# Altium project Screen test.PrjPcb
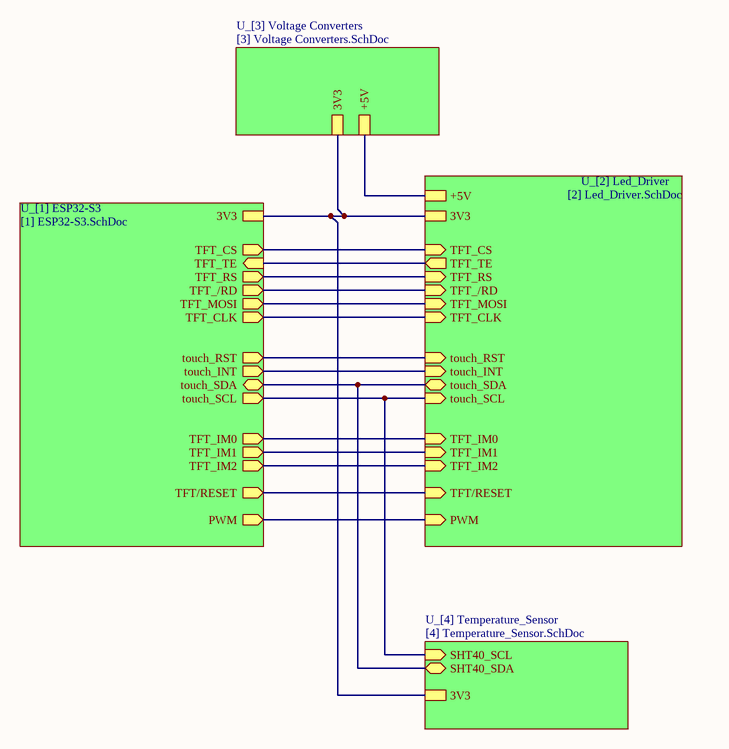
[diagram p0: [0] General.SchDoc]
5 sheets, 88 parts. Net scope: hierarchical (ports join the sheet entries above them; power ports are global).
Board file: ESP32-S3.PcbDoc
Sheets:
  [0] General.SchDoc
    U_[1] ESP32-S3 = [1] ESP32-S3.SchDoc
    U_[2] Led_Driver = [2] Led_Driver.SchDoc
    U_[4] Temperature_Sensor = [4] Temperature_Sensor.SchDoc
    U_[3] Voltage Converters = [3] Voltage Converters.SchDoc

## Sheet [0] General.SchDoc
size A4; Organization: Altium Limited; Address1: L3, 12a Rodborough Rd; Address2: Frenchs Forest; Address3: NSW; Address4: Australia 2086

### Sub-sheets
U_[1] ESP32-S3 = [1] ESP32-S3.SchDoc: TFT_CLK (out), TFT_CS (out), TFT_MOSI (out), touch_SCL (out), TFT_IM0 (out), TFT_IM1 (out), TFT_IM2 (out), touch_INT (out), TFT_TE (in), TFT_RS (out), TFT_/RD (out), TFT/RESET (out), touch_RST (out), PWM (out), touch_SDA (bidir), 3V3
U_[2] Led_Driver = [2] Led_Driver.SchDoc: PWM (in), TFT_TE (out), TFT_RS (in), TFT_/RD (in), TFT_IM0 (in), TFT_IM1 (in), TFT_IM2 (in), TFT/RESET (in), TFT_CLK (in), TFT_CS (in), TFT_MOSI (in), touch_INT (in), touch_RST (in), touch_SCL (in), touch_SDA (bidir), +5V, 3V3
U_[3] Voltage Converters = [3] Voltage Converters.SchDoc: +5V, 3V3
U_[4] Temperature_Sensor = [4] Temperature_Sensor.SchDoc: SHT40_SCL (in), SHT40_SDA (bidir), 3V3

### Nets
+5V: sheet U_[2] Led_Driver/+5V, sheet U_[3] Voltage Converters/+5V
VDD3P3: sheet U_[1] ESP32-S3/3V3, sheet U_[2] Led_Driver/3V3, sheet U_[4] Temperature_Sensor/3V3, sheet U_[3] Voltage Converters/3V3
TFT/RESET: sheet U_[1] ESP32-S3/TFT/RESET, sheet U_[2] Led_Driver/TFT/RESET
touch_RST: sheet U_[1] ESP32-S3/touch_RST, sheet U_[2] Led_Driver/touch_RST
NetJ2_4: sheet U_[1] ESP32-S3/touch_INT, sheet U_[2] Led_Driver/touch_INT
NetJ2_5: sheet U_[1] ESP32-S3/touch_SCL, sheet U_[2] Led_Driver/touch_SCL, sheet U_[4] Temperature_Sensor/SHT40_SCL
NetJ2_6: sheet U_[1] ESP32-S3/touch_SDA, sheet U_[2] Led_Driver/touch_SDA, sheet U_[4] Temperature_Sensor/SHT40_SDA
NetJ3_08: sheet U_[1] ESP32-S3/TFT_TE, sheet U_[2] Led_Driver/TFT_TE
NetJ3_09: sheet U_[1] ESP32-S3/TFT_CS, sheet U_[2] Led_Driver/TFT_CS
NetJ3_10: sheet U_[1] ESP32-S3/TFT_RS, sheet U_[2] Led_Driver/TFT_RS
NetJ3_11: sheet U_[1] ESP32-S3/TFT_CLK, sheet U_[2] Led_Driver/TFT_CLK
NetJ3_12: sheet U_[1] ESP32-S3/TFT_/RD, sheet U_[2] Led_Driver/TFT_/RD
NetJ3_13: sheet U_[1] ESP32-S3/TFT_MOSI, sheet U_[2] Led_Driver/TFT_MOSI
NetJ3_37: sheet U_[1] ESP32-S3/TFT_IM0, sheet U_[2] Led_Driver/TFT_IM0
NetJ3_38: sheet U_[1] ESP32-S3/TFT_IM1, sheet U_[2] Led_Driver/TFT_IM1
NetJ3_39: sheet U_[1] ESP32-S3/TFT_IM2, sheet U_[2] Led_Driver/TFT_IM2
NetU1_1: sheet U_[1] ESP32-S3/PWM, sheet U_[2] Led_Driver/PWM

### Notes on the sheet
- Title
- Size:
- Date:
- A4
- Number:
- Time:
- Revision:
- Sheet
- of
- File:

## Sheet [1] ESP32-S3.SchDoc: ESP32-S3
size OrCAD B; DocumentNumber: 01; Revision: 01; SheetNumber: 01
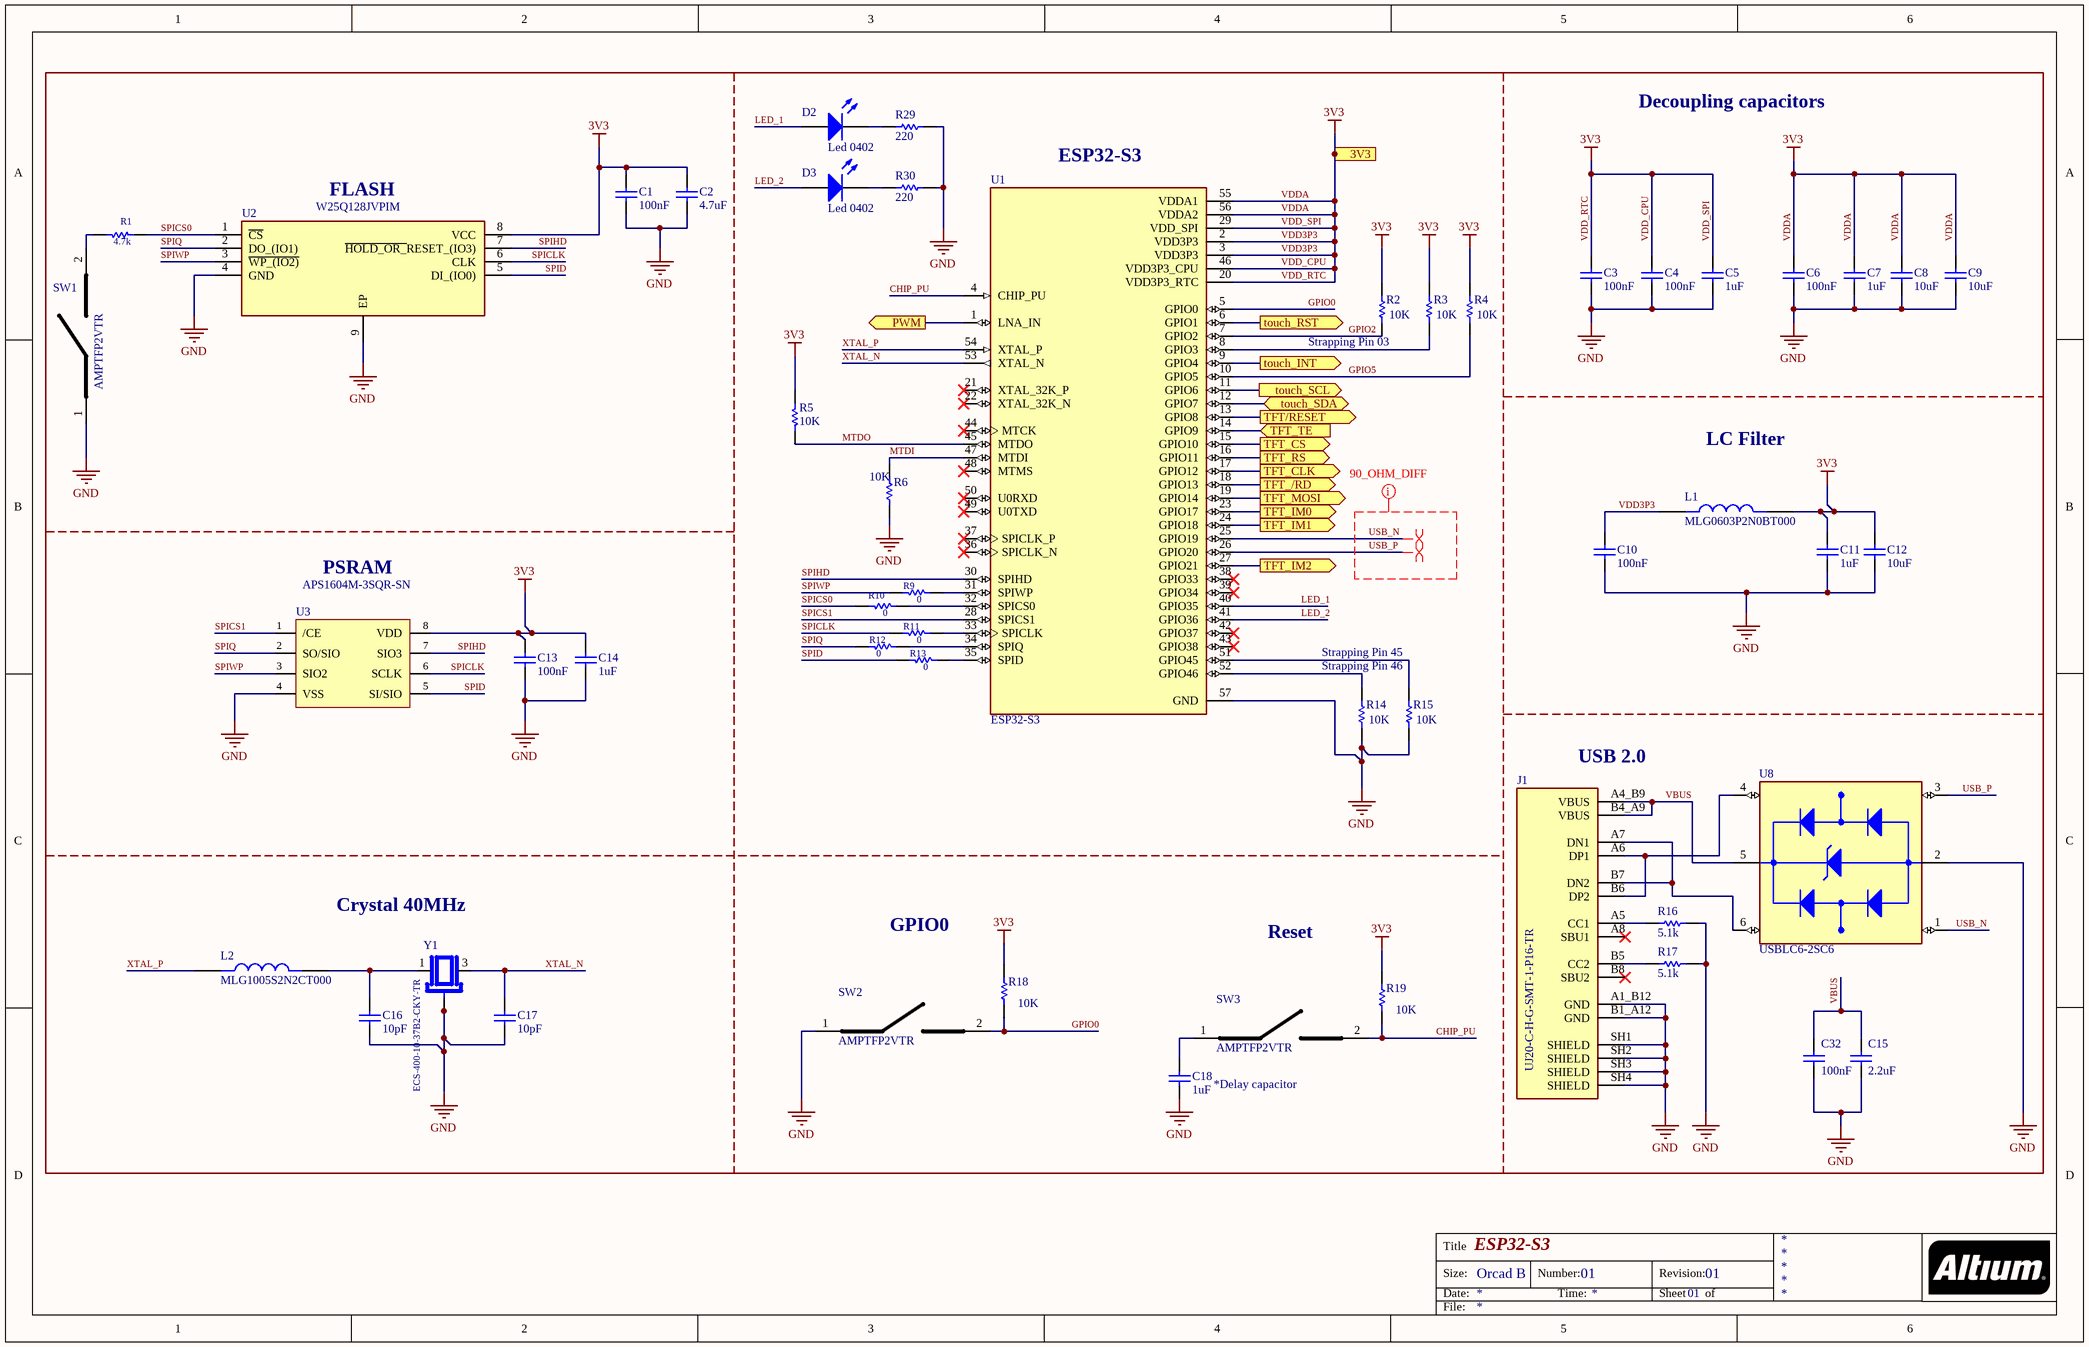
[diagram p1: [1] ESP32-S3.SchDoc]

### Parts
C1  100nF  [Capacitor 0402]
C2  4.7uF  [Capacitor 0402]
C3  100nF  [Capacitor 0402]
C4  100nF  [Capacitor 0402]
C5  1uF  [Capacitor 0402]
C6  100nF  [Capacitor 0402]
C7  1uF  [Capacitor 0402]
C8  10uF  [Capacitor 0603]
C9  10uF  [Capacitor 0603]
C10  100nF  [Capacitor 0402]
C11  1uF  [Capacitor 0402]
C12  10uF  [Capacitor 0603]
C13  100nF  [Capacitor 0402]
C14  1uF  [Capacitor 0402]
C15  2.2uF  [Capacitor 0402]
C16  10pF  [Capacitor 0402]
C17  10pF  [Capacitor 0402]
C18  1uF  [Capacitor 0402]
C32  100nF  [Capacitor 0402]
D2  Led 0402  [LED 0402]
D3  Led 0402  [LED 0402]
J1  UJ20-C-H-G-SMT-1-P16-TR  [SAMESKY_UJ20-C-H-G-SMT-1-P16-TR]
L1  MLG0603P2N0BT000  [INDC0603X33N]
L2  MLG1005S2N2CT000  [INDC1005X55N]
R1  4.7k  [Resistencia 0402]
R2  10K  [Resistencia 0402]
R3  10K  [Resistencia 0402]
R4  10K  [Resistencia 0402]
R5  10K  [Resistencia 0402]
R6  10K  [Resistencia 0402]
R9  0  [Resistencia 0402]
R10  0  [Resistencia 0402]
R11  0  [Resistencia 0402]
R12  0  [Resistencia 0402]
R13  0  [Resistencia 0402]
R14  10K  [Resistencia 0402]
R15  10K  [Resistencia 0402]
R16  5.1k  [Resistencia 0402]
R17  5.1k  [Resistencia 0402]
R18  10K  [Resistencia 0402]
R19  10K  [Resistencia 0402]
R29  220  [Resistencia 0402]
R30  220  [Resistencia 0402]
SW1  AMPTFP2VTR  [AMPTFP2VTR]
SW2  AMPTFP2VTR  [AMPTFP2VTR]
SW3  AMPTFP2VTR  [AMPTFP2VTR]
U1  ESP32-S3  [IC_ESP32-S3]
U2  W25Q128JVPIM  [SON127P600X500X80-9N-D]
U3  APS1604M-3SQR-SN  [SOIC127P600X165-8N]
U8  USBLC6-2SC6  [SOT95P280X145-6N]
Y1  ECS-400-10-37B2-CKY-TR  [XTAL_ECS-400-10-37B2-CKY-TR]

### Ports
3V3, PWM (out), TFT/RESET (out), TFT_/RD (out), TFT_CLK (out), TFT_CS (out), TFT_IM0 (out), TFT_IM1 (out), TFT_IM2 (out), TFT_MOSI (out), TFT_RS (out), TFT_TE (in), touch_INT (out), touch_RST (out), touch_SCL (out), touch_SDA (bidir)

### Nets
GND: C1.1 C2.1 C3.1 C4.1 C5.1 C6.1 C7.1 C8.1 C9.1 C10.1 C11.1 C12.1 C13.1 C14.1 C15.1 C16.1 C17.1 C18.1 C32.1 J1.A1_B12(GND) J1.B1_A12(GND) J1.SH1(SHIELD) J1.SH2(SHIELD) J1.SH3(SHIELD) J1.SH4(SHIELD) R6.1(A) R14.1(A) R15.1(A) R16.1(A) R17.1(A) R29.2(B) R30.2(B) SW1.1(COM) SW2.1(COM) U1.57(GND) U2.4(GND) U2.9(EP) U3.4(VSS) U8.2(GND) Y1.2(GND) Y1.4(GND)
VDD3P3: C1.2 C2.2 C3.2 C4.2 C5.2 C6.2 C7.2 C8.2 C9.2 C10.2 C11.2 C12.2 C13.2 C14.2 L1.1 L1.2 R2.2(B) R3.2(B) R4.2(B) R5.2(B) R18.2(B) R19.2(B) U1.2(VDD3P3) U1.3(VDD3P3) U1.20(VDD3P3_RTC) U1.29(VDD_SPI) U1.46(VDD3P3_CPU) U1.55(VDDA1) U1.56(VDDA2) U2.8(VCC) U3.8(VDD) ; port 3V3  [also labelled 3V3, VDD_CPU, VDD_RTC, VDD_SPI, VDDA]
CHIP_PU: R19.1(A) SW3.2(NO) U1.4(CHIP_PU)
GPIO0: R18.1(A) SW2.2(NO) U1.5(GPIO0)
GPIO2: R2.1(A) U1.7(GPIO2)
GPIO5: R4.1(A) U1.10(GPIO5)
LED_1: D2.1(A) U1.40(GPIO35)
LED_2: D3.1(A) U1.41(GPIO36)
MTDI: R6.2(B) U1.47(MTDI)
MTDO: R5.1(A) U1.45(MTDO)
SPICLK: R11.2(B) U2.6(CLK) U3.6(SCLK)
SPICS0: R1.1(A) R10.1(A) U2.1(~{CS})
SPICS1: U1.28(SPICS1) U3.1(/CE)
SPID: R13.2(B) U2.5(DI_(IO0)) U3.5(SI/SIO)
SPIHD: U1.30(SPIHD) U2.7(~{HOLD_OR_}RESET_(IO3)) U3.7(SIO3)
SPIQ: R12.2(B) U2.2(DO_(IO1)) U3.2(SO/SIO)
SPIWP: R9.2(B) U2.3(~{WP_(IO2)}) U3.3(SIO2)
TFT/RESET: U1.13(GPIO8) ; port TFT/RESET
touch_RST: U1.6(GPIO1) ; port touch_RST
USB_N: U1.25(GPIO19) U8.1(I/O1_IN)
USB_P: U1.26(GPIO20) U8.3(I/O2_IN)
VBUS: C15.2 C32.2 J1.A4_B9(VBUS) J1.B4_A9(VBUS) U8.5(VBUS)
XTAL_N: C17.2 U1.53(XTAL_N) Y1.3(OUT/IN)
XTAL_P: L2.1 U1.54(XTAL_P)
NetC16_2: C16.2 L2.2 Y1.1(IN/OUT)
NetC18_2: C18.2 SW3.1(COM)
NetD2_2: D2.2(K) R29.1(A)
NetD3_2: D3.2(K) R30.1(A)
NetJ1_A5: J1.A5(CC1) R16.2(B)
NetJ1_A6: J1.A6(DP1) J1.B6(DP2) U8.4(I/O2_OUT)
NetJ1_A7: J1.A7(DN1) J1.B7(DN2) U8.6(I/O1_OUT)
NetJ1_B5: J1.B5(CC2) R17.2(B)
NetJ2_4: U1.9(GPIO4) ; port touch_INT
NetJ2_5: U1.11(GPIO6) ; port touch_SCL
NetJ2_6: U1.12(GPIO7) ; port touch_SDA
NetJ3_08: U1.14(GPIO9) ; port TFT_TE
NetJ3_09: U1.15(GPIO10) ; port TFT_CS
NetJ3_10: U1.16(GPIO11) ; port TFT_RS
NetJ3_11: U1.17(GPIO12) ; port TFT_CLK
NetJ3_12: U1.18(GPIO13) ; port TFT_/RD
NetJ3_13: U1.19(GPIO14) ; port TFT_MOSI
NetJ3_37: U1.23(GPIO17) ; port TFT_IM0
NetJ3_38: U1.24(GPIO18) ; port TFT_IM1
NetJ3_39: U1.27(GPIO21) ; port TFT_IM2
NetR1_2: R1.2(B) SW1.2(NO)
NetR3_1: R3.1(A) U1.8(GPIO3)
NetR9_1: R9.1(A) U1.31(SPIWP)
NetR10_2: R10.2(B) U1.32(SPICS0)
NetR11_1: R11.1(A) U1.33(SPICLK)
NetR12_1: R12.1(A) U1.34(SPIQ)
NetR13_1: R13.1(A) U1.35(SPID)
NetR14_2: R14.2(B) U1.52(GPIO46)
NetR15_2: R15.2(B) U1.51(GPIO45)
NetU1_1: U1.1(LNA_IN) ; port PWM

Not connected (* = marked no-connect by the designer): J1 A8(SBU1)* B8(SBU2)*; U1 21(XTAL_32K_P)* 22(XTAL_32K_N)* 36(SPICLK_N)* 37(SPICLK_P)* 38(GPIO33)* 39(GPIO34)* 42(GPIO37)* 43(GPIO38)* 44(MTCK)* 48(MTMS)* 49(U0TXD)* 50(U0RXD)*

### Layout directives
differential pair; differential pair class 90_OHM_DIFF: USB_N, USB_P
mark named 90_OHM_DIFF: USB_N, USB_P

### Notes on the sheet
- Decoupling capacitors
- (near U2) FLASH
- (near U1) ESP32-S3
- (near R2) Strapping Pin 03
- LC Filter
- PSRAM
- Strapping Pin 45
- Strapping Pin 46
- (near J1) USB 2.0
- Crystal 40MHz
- GPIO0
- Reset
- *Delay capacitor
- Title
- Size:
- Date:
- Orcad B
- Number:
- Time:
- Revision:
- Sheet
- of
- File:

### Library data of the parts
C1-C7 C10 C11 C13-C18 C32 = Capacitor 0402: Capacitor Ceramico SMD 0402
C8 C9 C12 = Capacitor 0603: Capacitor Ceramico SMD 0603
D2 D3 = LED 0402: LED SMD 0402
J1 = UJ20-C-H-G-SMT-1-P16-TR: USB-C (USB TYPE-C) USB 2.0 Receptacle Connector 24 (16+8 Dummy) Position Surface Mount, Right Angle; Through Hole; MF: Same Sky; SnapEDA_Link: https://www.snapeda.com/parts/UJ20-C-H-G-SMT-1-P16-TR/Same+Sky/view-part/?ref=snap; Package: None; Value: *; MP: UJ20-C-H-G-SMT-1-P16-TR; Check_prices: https://www.snapeda.com/parts/UJ20-C-H-G-SMT-1-P16-TR/Same+Sky/view-part/?ref=eda
L1 = MLG0603P2N0BT000: 2 nH Unshielded Multilayer Inductor 600 mA 100mOhm Max 0201 (0603 Metric); MF: TDK; Price: None; Check_prices: https://www.snapeda.com/parts/MLG0603P2N0BT000/TDK/view-part/?ref=eda; Package: 0603 Taiyo Yuden; Purchase-URL: https://pricing.snapeda.com/search/part/MLG0603P2N0BT000/?ref=eda; SnapEDA_Link: https://www.snapeda.com/parts/MLG0603P2N0BT000/TDK/view-part/?ref=snap; Value: *; MP: MLG0603P2N0BT000; Availability: In Stock
L2 = MLG1005S2N2CT000: FIXED IND 2.2NH 900MA 150MOHM SM; MF: TDK Corporation; SnapEDA_Link: https://www.snapeda.com/parts/MLG1005S2N2CT000/TDK/view-part/?ref=snap; Package: 1005-2 TDK; Value: *; MP: MLG1005S2N2CT000; Check_prices: https://www.snapeda.com/parts/MLG1005S2N2CT000/TDK/view-part/?ref=eda
R1-R6 R9-R19 R29 R30 = Resistencia SMD 0402
SW1-SW3 = AMPTFP2VTR: Tactile Switch SPST-NO Top Actuated Surface Mount; Manufacturer_Name: Apem; Geometry.Height: 2.2mm; Mouser Part Number: 642-AMPTFP2VTR; Mouser Price/Stock: https://www.mouser.co.uk/ProductDetail/Apem/AMPTFP2VTR?qs=%252B9%2Fcbd0IE0SYwG%252BIJFZl2Q%3D%3D; Manufacturer_Part_Number: AMPTFP2VTR; Datasheet Link: https://www.mouser.se/datasheet/2/26/apem_appms00196-1-1733699.pdf
U1 = ESP32-S3: IC RF TxRx + MCU Bluetooth, WiFi 802.11b/g/n, Bluetooth v5.0 2.412GHz ~ 2.484GHz 56-VFQFN Exposed Pad; MF: Espressif Systems; Check_prices: https://www.snapeda.com/parts/ESP32-S3/Espressif+Systems/view-part/?ref=eda; Purchase-URL: https://pricing.snapeda.com/search/part/ESP32-S3/?ref=eda; Value: *; Availability: In Stock; Package: None; SnapEDA_Link: https://www.snapeda.com/parts/ESP32-S3/Espressif+Systems/view-part/?ref=snap; MP: ESP32-S3; Price: None
U2 = W25Q128JVPIM: 128M-bit Serial Flash Memory with uniform 4KB sectors and Dual/Quad SPI; Manufacturer_Name: Winbond; Geometry.Height: 0.8mm; Mouser Part Number: 454-W25Q128JVPIM; Mouser Price/Stock: https://www.mouser.co.uk/ProductDetail/Winbond/W25Q128JVPIM?qs=qSfuJ%252Bfl%2Fd62hi5N%252Bd7%252B%252BA%3D%3D; Manufacturer_Part_Number: W25Q128JVPIM; Datasheet Link: https://www.winbond.com/hq/search-resource-file.jsp?partNo=W25Q128JVPIM&type=datasheet
U3 = APS1604M-3SQR-SN: DRAM IoT RAM 16Mb QSPI (x1,x4) SDR 133/84MHz, RBX, 3V, Ind. Temp., SOP8
U8 = USBLC6-2SC6: 17V Clamp 5A (8/20Âµs) Ipp Tvs Diode Surface Mount SOT-23-6; MF: STMicroelectronics; Value: *; SnapEDA_Link: https://www.snapeda.com/parts/USBLC6-2SC6/STMicroelectronics/view-part/?ref=snap; Check_prices: https://www.snapeda.com/parts/USBLC6-2SC6/STMicroelectronics/view-part/?ref=eda; Purchase-URL: https://pricing.snapeda.com/search/part/USBLC6-2SC6/?ref=eda; Price: None; Availability: In Stock; Package: SOT-23-6 STMicroelectronics; MP: USBLC6-2SC6
Y1 = ECS-400-10-37B2-CKY-TR: Package: None; Price: None; Value: *; MP: ECS-400-10-37B2-CKY-TR; Availability: Unavailable

## Sheet [2] Led_Driver.SchDoc: Led Driver
size A4; DocumentNumber: 02; Revision: 01
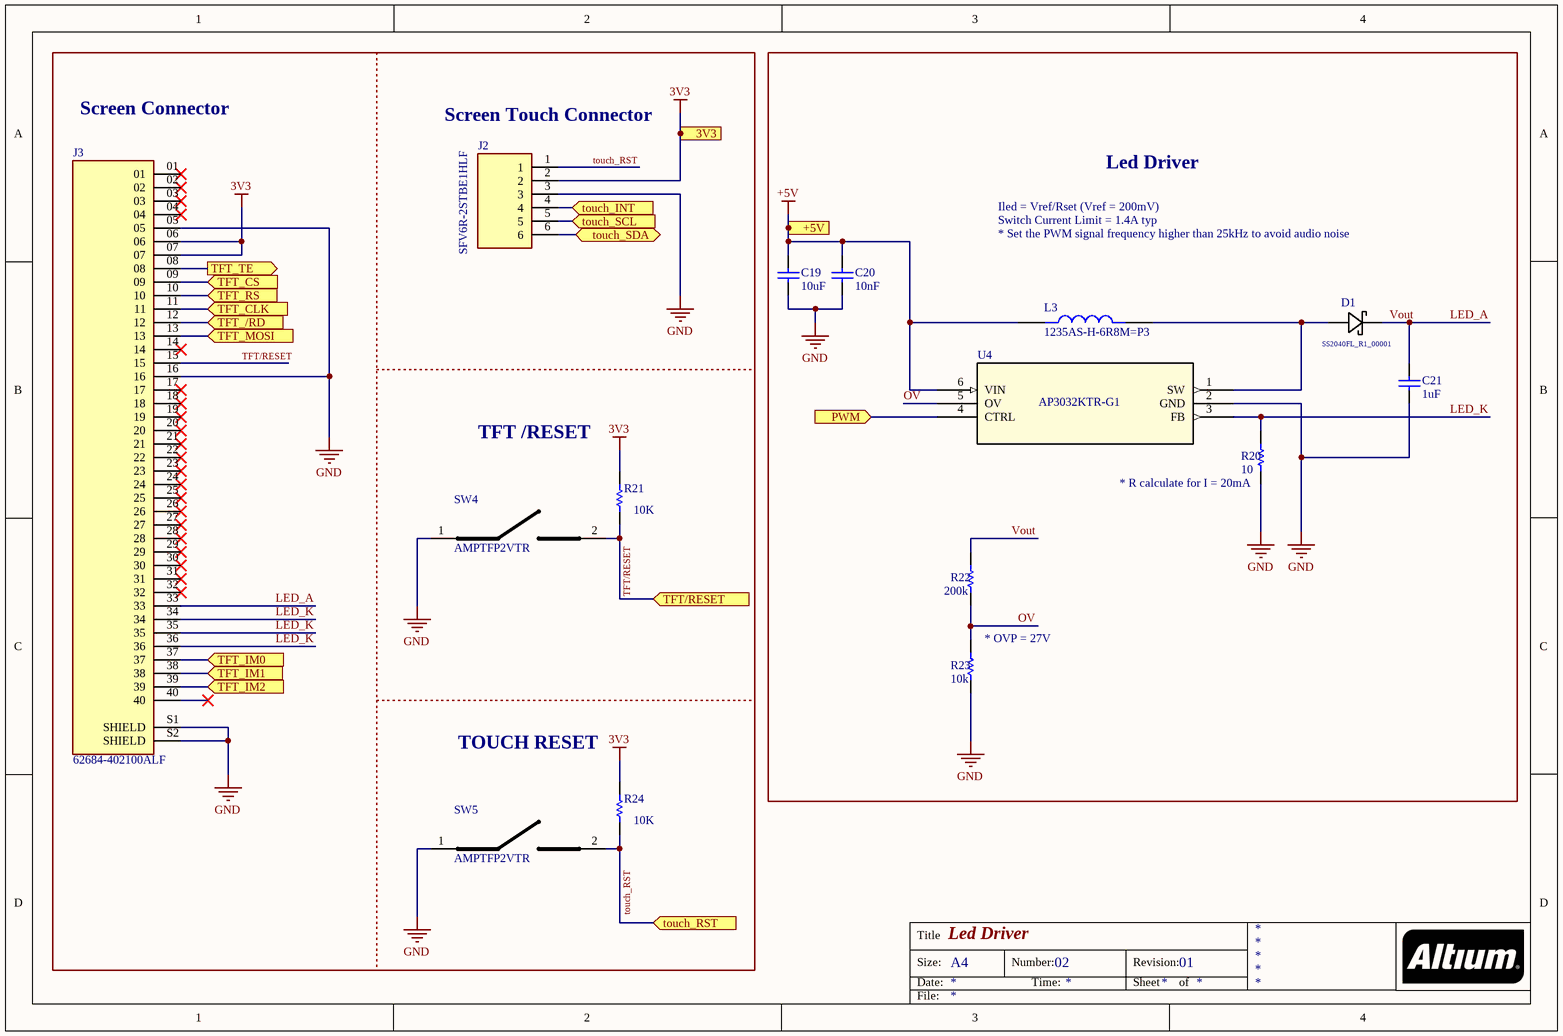
[diagram p2: [2] Led_Driver.SchDoc]

### Parts
C19  10uF  [Capacitor 0402]
C20  10nF  [Capacitor 0402]
C21  1uF  [Capacitor 0402]
D1  SS2040FL_R1_00001  [CR_R1_00001_PNJ]
J2  SFV6R-2STBE1HLF  [AMPHENOL_SFV6R-2STBE1HLF]
J3  62684-402100ALF  [AMPHENOL_62684-402100ALF]
L3  1235AS-H-6R8M=P3  [IND_1235AS-H-6R8M=P3]
R20  10  [Resistencia 0402]
R21  10K  [Resistencia 0402]
R22  200k  [Resistencia 0402]
R23  10k  [Resistencia 0402]
R24  10K  [Resistencia 0402]
SW4  AMPTFP2VTR  [AMPTFP2VTR]
SW5  AMPTFP2VTR  [AMPTFP2VTR]
U4  AP3032KTR-G1  [SOT23-6_DIO]

### Blocks framed on the sheet
Led Driver: C19-C21 D1 L3 R20 R22 R23 U4

### Ports
3V3, +5V, PWM (in), TFT/RESET (in), TFT_/RD (in), TFT_CLK (in), TFT_CS (in), TFT_IM0 (in), TFT_IM1 (in), TFT_IM2 (in), TFT_MOSI (in), TFT_RS (in), TFT_TE (out), touch_INT (in), touch_RST (in), touch_SCL (in), touch_SDA (bidir)

### Nets
3V3: J2.2 J3.06 J3.07 R21.2(B) R24.2(B) ; port 3V3  [project net VDD3P3]
+5V: C19.2 C20.2 L3.1 U4.6(VIN) ; port +5V
GND: C19.1 C20.1 C21.1 J2.3 J3.05 J3.16 J3.S1(SHIELD) J3.S2(SHIELD) R20.1(A) R23.1(A) SW4.1(COM) SW5.1(COM) U4.2(GND)
LED_A: C21.2 D1.1 J3.33 R22.2(B)  [also labelled Vout]
LED_K: J3.34 J3.35 J3.36 R20.2(B) U4.3(FB)
OV: R22.1(A) R23.2(B) U4.5(OV)
TFT/RESET: J3.15 R21.1(A) SW4.2(NO) ; port TFT/RESET
touch_RST: J2.1 R24.1(A) SW5.2(NO) ; port touch_RST
NetD1_2: D1.2 L3.2 U4.1(SW)
NetJ2_4: J2.4 ; port touch_INT
NetJ2_5: J2.5 ; port touch_SCL
NetJ2_6: J2.6 ; port touch_SDA
NetJ3_08: J3.08 ; port TFT_TE
NetJ3_09: J3.09 ; port TFT_CS
NetJ3_10: J3.10 ; port TFT_RS
NetJ3_11: J3.11 ; port TFT_CLK
NetJ3_12: J3.12 ; port TFT_/RD
NetJ3_13: J3.13 ; port TFT_MOSI
NetJ3_37: J3.37 ; port TFT_IM0
NetJ3_38: J3.38 ; port TFT_IM1
NetJ3_39: J3.39 ; port TFT_IM2
NetU1_1: U4.4(CTRL) ; port PWM

Not connected (* = marked no-connect by the designer): J3 01* 02* 03* 04* 14* 17* 18* 19* 20* 21* 22* 23* 24* 25* 26* 27* 28* 29* 30* 31* 32* 40*

### Notes on the sheet
- Screen Connector
- (near J2) Screen Touch Connector
- Iled = Vref/Rset (Vref = 200mV)
- Switch Current Limit = 1.4A typ
- * Set the PWM signal frequency higher than 25kHz to avoid audio noise
- TFT /RESET
- (near R20) * R calculate for I = 20mA
- (near R23) * OVP = 27V
- TOUCH RESET
- Title
- Size:
- Date:
- A4
- Number:
- Time:
- Revision:
- Sheet
- of
- File:

### Library data of the parts
C19-C21 = Capacitor 0402: Capacitor Ceramico SMD 0402
D1 = SS2040FL_R1_00001: Description; Manufacturer_Name: Panjit; Copyright: Copyright (C) 2026 Ultra Librarian. All rights reserved.; Manufacturer_Part_Number: SS2040FL_R1_00001
J3 = 62684-402100ALF: Conn Rect FPC/FFC 40Cnt SMT OPUSeries ZIF 0.5mmPitch RtAngle | Amphenol FCI (Amphenol CS) 62684-402100ALF; MF: Amphenol ICC; SnapEDA_Link: https://www.snapeda.com/parts/62684-402100ALF/Amphenol+FCI/view-part/?ref=snap; Package: None; Value: *; MP: 62684-402100ALF; Check_prices: https://www.snapeda.com/parts/62684-402100ALF/Amphenol+FCI/view-part/?ref=eda
L3 = 1235AS-H-6R8M=P3: Inductor with Inductance: 6.8uH Tol. +/-20%, Package: 1818 (4745); MF: Murata; Purchase-URL: https://pricing.snapeda.com/search/part/1235AS-H-6R8M=P3/?ref=eda; Package: NONSTANDARD; MP: 1235AS-H-6R8M=P3; Value: *; SnapEDA_Link: https://www.snapeda.com/parts/1235AS-H-6R8M=P3/Murata/view-part/1512974/?ref=snap; Check_prices: https://www.snapeda.com/parts/1235AS-H-6R8M=P3/Murata/view-part/1512974/?ref=eda; Digi-Key_Part_Number: 490-14206-1-ND
R20-R24 = Resistencia SMD 0402
SW4 SW5 = AMPTFP2VTR: as SW1 on sheet [1] ESP32-S3; Mouser Part Number: 642-AMPTFP2VTR; Mouser Price/Stock: https://www.mouser.co.uk/ProductDetail/Apem/AMPTFP2VTR?qs=%252B9%2Fcbd0IE0SYwG%252BIJFZl2Q%3D%3D; Manufacturer_Part_Number: AMPTFP2VTR; Datasheet Link: https://www.mouser.se/datasheet/2/26/apem_appms00196-1-1733699.pdf
U4 = AP3032KTR-G1: Description; Manufacturer_Name: Diodes Inc; Copyright: Copyright (C) 2025 Ultra Librarian. All rights reserved.; Manufacturer_Part_Number: AP3032KTR-G1; RefDes: RefDes; Type: Type
J2 = SFV6R-2STBE1HLF: Package: None; Price: None; Value: *; MP: SFV6R-2STBE1HLF; Availability: Unavailable

## Sheet [4] Temperature_Sensor.SchDoc
size A4; Organization: Altium Limited; Address1: L3, 12a Rodborough Rd; Address2: Frenchs Forest; Address3: NSW; Address4: Australia 2086
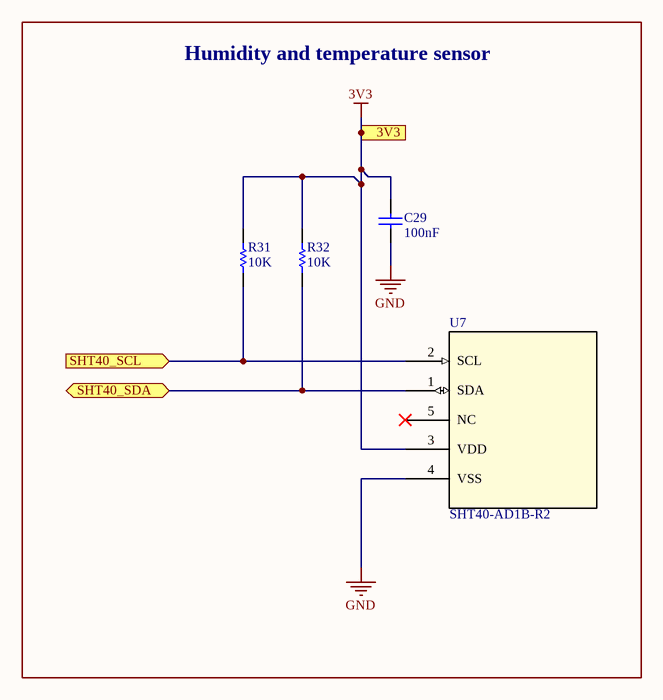
[diagram p3: [4] Temperature_Sensor.SchDoc]

### Parts
C29  100nF  [Capacitor 0402]
R31  10K  [Resistencia 0402]
R32  10K  [Resistencia 0402]
U7  SHT40-AD1B-R2  [SHT4x_SEN]

### Blocks framed on the sheet
Humidity and temperature sensor: C29 R31 R32 U7

### Ports
3V3, SHT40_SCL (in), SHT40_SDA (bidir)

### Nets
3V3: C29.2 R31.2(B) R32.2(B) U7.3(VDD) ; port 3V3  [project net VDD3P3]
GND: C29.1 U7.4(VSS)
NetJ2_5: R31.1(A) U7.2(SCL) ; port SHT40_SCL
NetJ2_6: R32.1(A) U7.1(SDA) ; port SHT40_SDA

Not connected (* = marked no-connect by the designer): U7 5(NC)*

### Notes on the sheet
- Title
- Size:
- Date:
- A4
- Number:
- Time:
- Revision:
- Sheet
- of
- File:

### Library data of the parts
C29 = Capacitor 0402: Capacitor Ceramico SMD 0402
R31 R32 = Resistencia SMD 0402
U7 = SHT40-AD1B-R2: Humidity, Temperature 0 ~ 100% RH I2C ±1.8% RH Surface Mount; Manufacturer_Name: Sensirion; Copyright: Copyright (C) 2026 Ultra Librarian. All rights reserved.; Manufacturer_Part_Number: SHT40-AD1B-R2; RefDes: RefDes; Type: Type

## Sheet [3] Voltage Converters.SchDoc
size A4; Organization: Altium Limited; Address1: L3, 12a Rodborough Rd; Address2: Frenchs Forest; Address3: NSW; Address4: Australia 2086
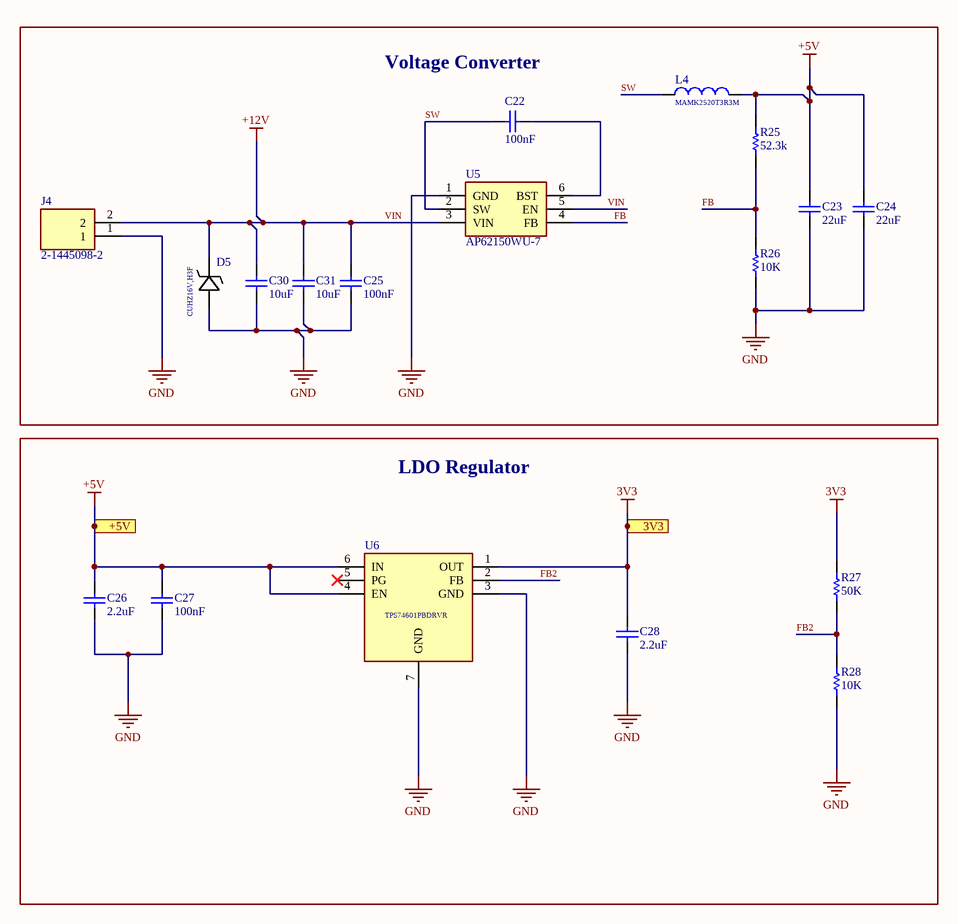
[diagram p4: [3] Voltage Converters.SchDoc]

### Parts
C22  100nF  [Capacitor 0402]
C23  22uF  [CAPACITOR 0805]
C24  22uF  [CAPACITOR 0805]
C25  100nF  [Capacitor 0402]
C26  2.2uF  [CAPACITOR 0805]
C27  100nF  [Capacitor 0402]
C28  2.2uF  [CAPACITOR 0805]
C30  10uF  [CAPACITOR 0805]
C31  10uF  [CAPACITOR 0805]
D5  CUHZ16V,H3F  [SOD-323HEUS2H_TOS]
J4  2-1445098-2  [214450982]
L4  MAMK2520T3R3M  [INDC2520X120N]
R25  52.3k  [Resistencia 0402]
R26  10K  [Resistencia 0402]
R27  50K  [Resistencia 0402]
R28  10K  [Resistencia 0402]
U5  AP62150WU-7  [SOT95P280X100-6N]
U6  TPS74601PBDRVR  [SON65P200X200X80-7N]

### Blocks framed on the sheet
Voltage Converter: C22-C25 C30 C31 D5 J4 L4 R25 R26 U5
LDO Regulator: C26-C28 R27 R28 U6

### Ports
3V3, +5V

### Nets
3V3: C28.2 R27.2(B) U6.1(OUT) ; port 3V3  [project net VDD3P3]
+5V: C23.2 C24.2 C26.2 C27.2 L4.2 R25.2(B) U6.4(EN) U6.6(IN) ; port +5V
GND: C23.1 C24.1 C25.1 C26.1 C27.1 C28.1 C30.1 C31.1 D5.2(ANODE) J4.1 R26.1(A) R28.1(A) U5.1(GND) U6.3(GND) U6.7(GND)
VIN: C25.2 C30.2 C31.2 D5.1(CATHODE) J4.2 U5.3(VIN) U5.5(EN)  [also labelled +12V]
FB: R25.1(A) R26.2(B) U5.4(FB)
FB2: R27.1(A) R28.2(B) U6.2(FB)
SW: C22.2 L4.1 U5.2(SW)
NetC22_1: C22.1 U5.6(BST)

Not connected (* = marked no-connect by the designer): U6 5(PG)*

### Notes on the sheet
- Title
- Size:
- Date:
- A4
- Number:
- Time:
- Revision:
- Sheet
- of
- File:

### Library data of the parts
C22 C25 C27 = Capacitor 0402: Capacitor Ceramico SMD 0402
C23 C24 C26 C28 C30 C31 = Capacitor 0805: Capacitor Cerámico SMD 0805
D5 = CUHZ16V,H3F: 16 V TVS Diode, SOD-323HE(US2H); Manufacturer_Name: Toshiba Electronic Devices & Storage Corp.; Copyright: Copyright (C) 2025 Ultra Librarian. All rights reserved.; Manufacturer_Part_Number: CUHZ16V,H3F
J4 = 2-1445098-2: Configuration Features: Number of Rows 1; Manufacturer_Name: TE Connectivity; Geometry.Height: 5.67mm; Mouser Part Number: 571-2-1445098-2; Mouser Price/Stock: https://www.mouser.co.uk/ProductDetail/TE-Connectivity-AMP/2-1445098-2?qs=Eu63EZxBwKKSsdV7%2Fa6T1Q%3D%3D; Manufacturer_Part_Number: 2-1445098-2; Datasheet Link: https://www.te.com/commerce/DocumentDelivery/DDEController?Action=srchrtrv&DocNm=micro-mate-n-lok-connector-qrg&DocType=Data%20Sheet&DocLang=English&PartCntxt=2-1445098-2&DocFormat=pdf
L4 = MAMK2520T3R3M: 3.3 ÂµH Shielded Drum Core, Wirewound Inductor 1.7 A 156mOhm Max 1008 (2520 Metric); MF: Taiyo Yuden; SnapEDA_Link: https://www.snapeda.com/parts/MAMK2520T3R3M/Taiyo+Yuden/view-part/?ref=snap; Package: 2520 Taiyo Yuden; Value: *; MP: MAMK2520T3R3M; Check_prices: https://www.snapeda.com/parts/MAMK2520T3R3M/Taiyo+Yuden/view-part/?ref=eda
R25-R28 = Resistencia SMD 0402
U5 = AP62150WU-7: Switching Voltage Regulators DCDC Conv HV Buck TSOT26 T&R 3K; Manufacturer_Name: Diodes Incorporated; Geometry.Height: 1mm; Mouser Part Number: 621-AP62150WU-7; Mouser Price/Stock: https://www.mouser.co.uk/ProductDetail/Diodes-Incorporated/AP62150WU-7?qs=yqaQSyyJnNgGPHe5Vg29cg%3D%3D; Manufacturer_Part_Number: AP62150WU-7; Datasheet Link: https://www.diodes.com//assets/Datasheets/AP62150.pdf
U6 = TPS74601PBDRVR: Adjustable 1-A low-dropout (LDO) linear regulator with power good; Manufacturer_Name: Texas Instruments; Geometry.Height: 0.8mm; Mouser Part Number: 595-TPS74601PBDRVR; Mouser Price/Stock: https://www.mouser.co.uk/ProductDetail/Texas-Instruments/TPS74601PBDRVR?qs=PqoDHHvF64%252B93w4aKhWy6Q%3D%3D; Manufacturer_Part_Number: TPS74601PBDRVR; Datasheet Link: http://www.ti.com/lit/gpn/TPS746

## Nets that join several sheets
+5V: [2] Led_Driver (C19.2 C20.2 L3.1 U4.6), [3] Voltage Converters (8 pins)
GND: [1] ESP32-S3 (41 pins), [2] Led_Driver (13 pins), [4] Temperature_Sensor (C29.1 U7.4), [3] Voltage Converters (15 pins)
VDD3P3: [1] ESP32-S3 (31 pins), [2] Led_Driver (5 pins), [4] Temperature_Sensor (C29.2 R31.2 R32.2 U7.3), [3] Voltage Converters (C28.2 R27.2 U6.1)
NetJ2_4: [1] ESP32-S3 (U1.9), [2] Led_Driver (J2.4)
NetJ2_5: [1] ESP32-S3 (U1.11), [2] Led_Driver (J2.5), [4] Temperature_Sensor (R31.1 U7.2)
NetJ2_6: [1] ESP32-S3 (U1.12), [2] Led_Driver (J2.6), [4] Temperature_Sensor (R32.1 U7.1)
NetJ3_08: [1] ESP32-S3 (U1.14), [2] Led_Driver (J3.08)
NetJ3_09: [1] ESP32-S3 (U1.15), [2] Led_Driver (J3.09)
NetJ3_10: [1] ESP32-S3 (U1.16), [2] Led_Driver (J3.10)
NetJ3_11: [1] ESP32-S3 (U1.17), [2] Led_Driver (J3.11)
NetJ3_12: [1] ESP32-S3 (U1.18), [2] Led_Driver (J3.12)
NetJ3_13: [1] ESP32-S3 (U1.19), [2] Led_Driver (J3.13)
NetJ3_37: [1] ESP32-S3 (U1.23), [2] Led_Driver (J3.37)
NetJ3_38: [1] ESP32-S3 (U1.24), [2] Led_Driver (J3.38)
NetJ3_39: [1] ESP32-S3 (U1.27), [2] Led_Driver (J3.39)
NetU1_1: [1] ESP32-S3 (U1.1), [2] Led_Driver (U4.4)
TFT/RESET: [1] ESP32-S3 (U1.13), [2] Led_Driver (J3.15 R21.1 SW4.2)
touch_RST: [1] ESP32-S3 (U1.6), [2] Led_Driver (J2.1 R24.1 SW5.2)